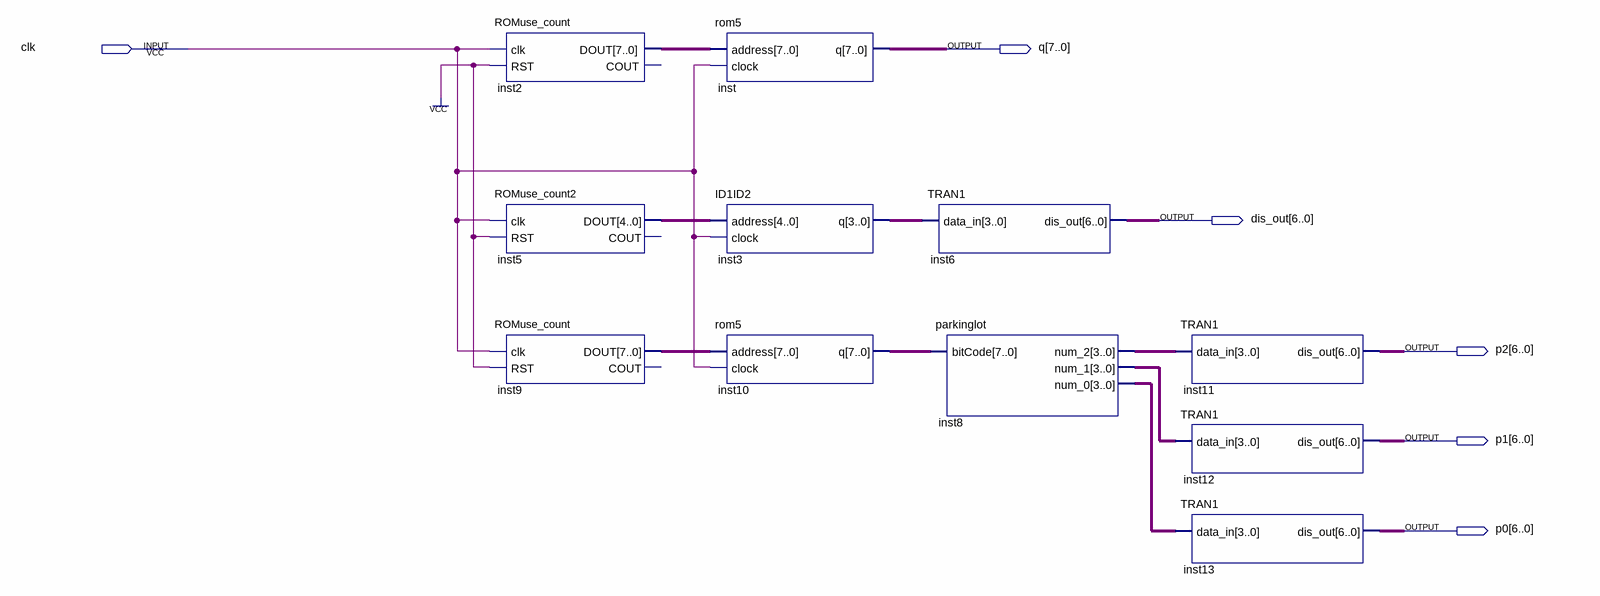
[diagram p0: schematic sheet]
// Quartus schematic ROMuse.bdf as structural Verilog: 11 symbols, 6 pins
module ROMuse (
  input  clk,
  output [7:0] q,
  output [6:0] dis_out,
  output [6:0] p2,
  output [6:0] p1,
  output [6:0] p0
);

  wire [3:0] inst3_q, inst8_num_0, inst8_num_1, inst8_num_2;
  wire [4:0] inst5_dout;
  wire [7:0] inst2_dout, inst9_dout, inst10_q;

  ROMuse_count inst2 (.clk(clk), .RST(1'b1), .DOUT(inst2_dout));  // open: COUT
  ROMuse_count2 inst5 (.clk(clk), .RST(1'b1), .DOUT(inst5_dout));  // open: COUT
  ROMuse_count inst9 (.clk(clk), .RST(1'b1), .DOUT(inst9_dout));  // open: COUT
  rom5 inst (.address(inst2_dout), .clock(clk), .q(q));
  ID1ID2 inst3 (.address(inst5_dout), .clock(clk), .q(inst3_q));
  rom5 inst10 (.address(inst9_dout), .clock(clk), .q(inst10_q));
  TRAN1 inst6 (.data_in(inst3_q), .dis_out(dis_out));
  parkinglot inst8 (.bitCode(inst10_q), .num_2(inst8_num_2), .num_1(inst8_num_1), .num_0(inst8_num_0));
  TRAN1 inst11 (.data_in(inst8_num_2), .dis_out(p2));
  TRAN1 inst12 (.data_in(inst8_num_1), .dis_out(p1));
  TRAN1 inst13 (.data_in(inst8_num_0), .dis_out(p0));
endmodule
